# Altium schematic sheet efuse.SchDoc
size 482 x 208 mm; SheetNumber: 1; SheetTotal: 2
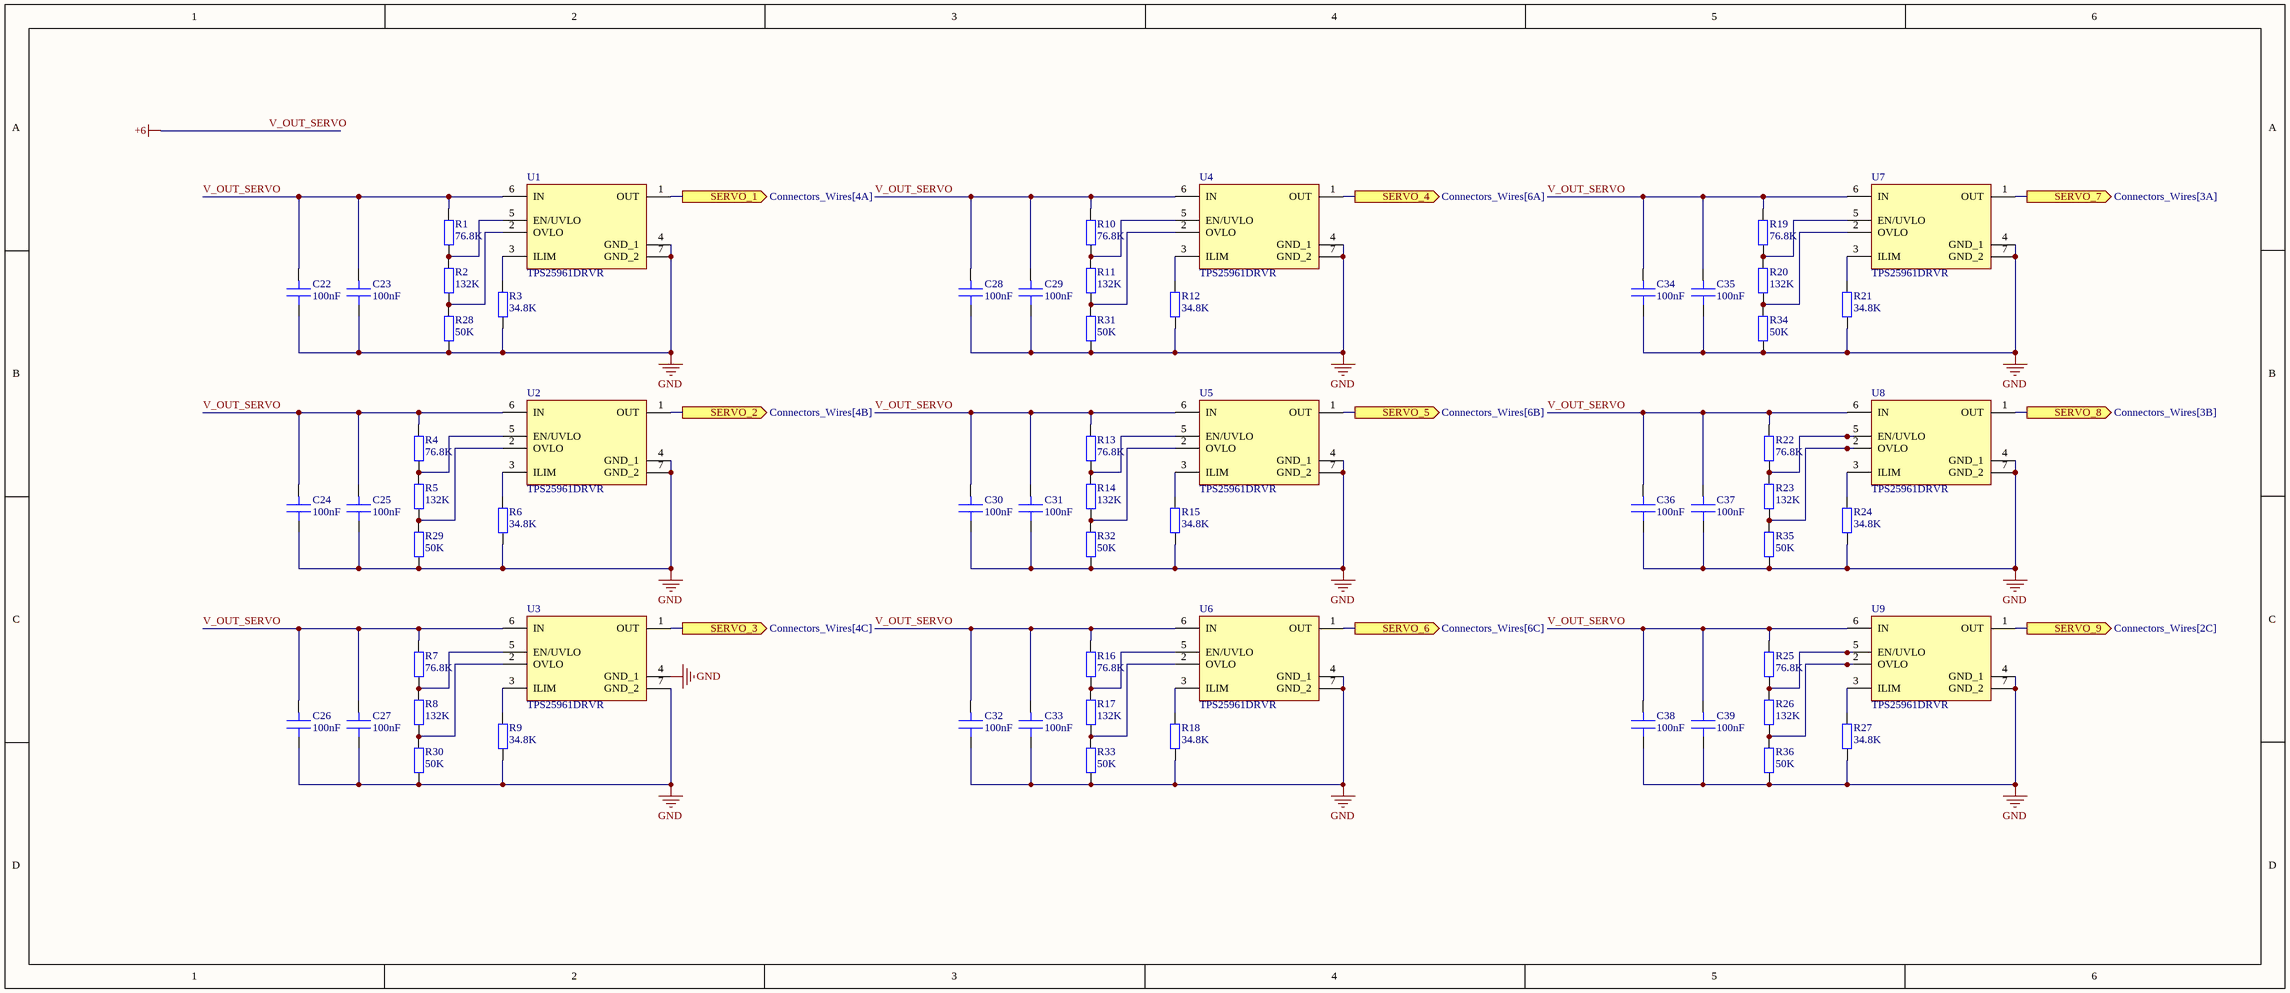
[diagram p0: efuse.SchDoc]

## Parts
C22  100nF  [IPC C C0402 NO SILK]
C23  100nF  [IPC C C0402 NO SILK]
C24  100nF  [IPC C C0402 NO SILK]
C25  100nF  [IPC C C0402 NO SILK]
C26  100nF  [IPC C C0402 NO SILK]
C27  100nF  [IPC C C0402 NO SILK]
C28  100nF  [IPC C C0402 NO SILK]
C29  100nF  [IPC C C0402 NO SILK]
C30  100nF  [IPC C C0402 NO SILK]
C31  100nF  [IPC C C0402 NO SILK]
C32  100nF  [IPC C C0402 NO SILK]
C33  100nF  [IPC C C0402 NO SILK]
C34  100nF  [IPC C C0402 NO SILK]
C35  100nF  [IPC C C0402 NO SILK]
C36  100nF  [IPC C C0402 NO SILK]
C37  100nF  [IPC C C0402 NO SILK]
C38  100nF  [IPC C C0402 NO SILK]
C39  100nF  [IPC C C0402 NO SILK]
R1  76.8K  [IPC C R0402 NO SILK]
R2  132K  [IPC C R0402 NO SILK]
R3  34.8K  [IPC C R0402 NO SILK]
R4  76.8K  [IPC C R0402 NO SILK]
R5  132K  [IPC C R0402 NO SILK]
R6  34.8K  [IPC C R0402 NO SILK]
R7  76.8K  [IPC C R0402 NO SILK]
R8  132K  [IPC C R0402 NO SILK]
R9  34.8K  [IPC C R0402 NO SILK]
R10  76.8K  [IPC C R0402 NO SILK]
R11  132K  [IPC C R0402 NO SILK]
R12  34.8K  [IPC C R0402 NO SILK]
R13  76.8K  [IPC C R0402 NO SILK]
R14  132K  [IPC C R0402 NO SILK]
R15  34.8K  [IPC C R0402 NO SILK]
R16  76.8K  [IPC C R0402 NO SILK]
R17  132K  [IPC C R0402 NO SILK]
R18  34.8K  [IPC C R0402 NO SILK]
R19  76.8K  [IPC C R0402 NO SILK]
R20  132K  [IPC C R0402 NO SILK]
R21  34.8K  [IPC C R0402 NO SILK]
R22  76.8K  [IPC C R0402 NO SILK]
R23  132K  [IPC C R0402 NO SILK]
R24  34.8K  [IPC C R0402 NO SILK]
R25  76.8K  [IPC C R0402 NO SILK]
R26  132K  [IPC C R0402 NO SILK]
R27  34.8K  [IPC C R0402 NO SILK]
R28  50K  [IPC C R0402 NO SILK]
R29  50K  [IPC C R0402 NO SILK]
R30  50K  [IPC C R0402 NO SILK]
R31  50K  [IPC C R0402 NO SILK]
R32  50K  [IPC C R0402 NO SILK]
R33  50K  [IPC C R0402 NO SILK]
R34  50K  [IPC C R0402 NO SILK]
R35  50K  [IPC C R0402 NO SILK]
R36  50K  [IPC C R0402 NO SILK]
U1  TPS25961DRVR  [TPS25961DRVR-Footprint-1]
U2  TPS25961DRVR  [TPS25961DRVR-Footprint-1]
U3  TPS25961DRVR  [TPS25961DRVR-Footprint-1]
U4  TPS25961DRVR  [TPS25961DRVR-Footprint-1]
U5  TPS25961DRVR  [TPS25961DRVR-Footprint-1]
U6  TPS25961DRVR  [TPS25961DRVR-Footprint-1]
U7  TPS25961DRVR  [TPS25961DRVR-Footprint-1]
U8  TPS25961DRVR  [TPS25961DRVR-Footprint-1]
U9  TPS25961DRVR  [TPS25961DRVR-Footprint-1]

## Ports
SERVO_1 (out, see Connectors_Wires[4A]), SERVO_2 (out, see Connectors_Wires[4B]), SERVO_3 (out, see Connectors_Wires[4C]), SERVO_4 (out, see Connectors_Wires[6A]), SERVO_5 (out, see Connectors_Wires[6B]), SERVO_6 (out, see Connectors_Wires[6C]), SERVO_7 (out, see Connectors_Wires[3A]), SERVO_8 (out, see Connectors_Wires[3B]), SERVO_9 (out, see Connectors_Wires[2C])

## Nets
GND: C22.2 C23.2 C24.2 C25.2 C26.2 C27.2 C28.2 C29.2 C30.2 C31.2 C32.2 C33.2 C34.2 C35.2 C36.2 C37.2 C38.2 C39.2 R3.1 R6.1 R9.1 R12.1 R15.1 R18.1 R21.1 R24.1 R27.1 R28.1 R29.1 R30.1 R31.1 R32.1 R33.1 R34.1 R35.1 R36.1 U1.4(GND_1) U1.7(GND_2) U2.4(GND_1) U2.7(GND_2) U3.4(GND_1) U3.7(GND_2) U4.4(GND_1) U4.7(GND_2) U5.4(GND_1) U5.7(GND_2) U6.4(GND_1) U6.7(GND_2) U7.4(GND_1) U7.7(GND_2) U8.4(GND_1) U8.7(GND_2) U9.4(GND_1) U9.7(GND_2)
V_OUT_SERVO: C22.1 C23.1 C24.1 C25.1 C26.1 C27.1 C28.1 C29.1 C30.1 C31.1 C32.1 C33.1 C34.1 C35.1 C36.1 C37.1 C38.1 C39.1 R1.2 R4.2 R7.2 R10.2 R13.2 R16.2 R19.2 R22.2 R25.2 U1.6(IN) U2.6(IN) U3.6(IN) U4.6(IN) U5.6(IN) U6.6(IN) U7.6(IN) U8.6(IN) U9.6(IN)  [also labelled +6]
SERVO_1: U1.1(OUT) ; port SERVO_1
SERVO_2: U2.1(OUT) ; port SERVO_2
SERVO_3: U3.1(OUT) ; port SERVO_3
SERVO_4: U4.1(OUT) ; port SERVO_4
SERVO_5: U5.1(OUT) ; port SERVO_5
SERVO_6: U6.1(OUT) ; port SERVO_6
SERVO_7: U7.1(OUT) ; port SERVO_7
SERVO_8: U8.1(OUT) ; port SERVO_8
SERVO_9: U9.1(OUT) ; port SERVO_9
NetR1_1: R1.1 R2.2 U1.5(EN/UVLO)
NetR2_1: R2.1 R28.2 U1.2(OVLO)
NetR3_2: R3.2 U1.3(ILIM)
NetR4_1: R4.1 R5.2 U2.5(EN/UVLO)
NetR5_1: R5.1 R29.2 U2.2(OVLO)
NetR6_2: R6.2 U2.3(ILIM)
NetR7_1: R7.1 R8.2 U3.5(EN/UVLO)
NetR8_1: R8.1 R30.2 U3.2(OVLO)
NetR9_2: R9.2 U3.3(ILIM)
NetR10_1: R10.1 R11.2 U4.5(EN/UVLO)
NetR11_1: R11.1 R31.2 U4.2(OVLO)
NetR12_2: R12.2 U4.3(ILIM)
NetR13_1: R13.1 R14.2 U5.5(EN/UVLO)
NetR14_1: R14.1 R32.2 U5.2(OVLO)
NetR15_2: R15.2 U5.3(ILIM)
NetR16_1: R16.1 R17.2 U6.5(EN/UVLO)
NetR17_1: R17.1 R33.2 U6.2(OVLO)
NetR18_2: R18.2 U6.3(ILIM)
NetR19_1: R19.1 R20.2 U7.5(EN/UVLO)
NetR20_1: R20.1 R34.2 U7.2(OVLO)
NetR21_2: R21.2 U7.3(ILIM)
NetR22_1: R22.1 R23.2 U8.5(EN/UVLO)
NetR23_1: R23.1 R35.2 U8.2(OVLO)
NetR24_2: R24.2 U8.3(ILIM)
NetR25_1: R25.1 R26.2 U9.5(EN/UVLO)
NetR26_1: R26.1 R36.2 U9.2(OVLO)
NetR27_2: R27.2 U9.3(ILIM)

## Library data of the parts
C22-C39 = CMP-002-000000-2: Input capacitor; Value: 100nF; Design Item ID: Generic CAP 0402; Source: Schlib1.SchLib
R1-R36 = CMP-008-000000-2: Generic RES 0402; Source: Schlib1.SchLib; Design Item ID: Generic RES 0402
  R1 R4 R7 R10 R13 R16 R19 R22 R25: Value: 76.8K
  R2 R5 R8 R11 R14 R17 R20 R23 R26: Value: 132K
  R3 R6 R9 R12 R15 R18 R21 R24 R27: Value: 34.8K
  R28-R36: Value: 50K
U1-U9 = CMP-00038-2: 2.7-V TO 19-V 100-M EFUSE WITH O Hot Swap Controller 1 Channel General Purpose 6-WSON (2x2); Manufacturer Lifecycle Status: ACTIVE; Thickness: 750µm; Height: 800µm; RoHS: Compliant; Lifecycle Status: Production; Length: 2mm; Width: 2mm; Pins: 6